# Altium schematic sheet 50Hz_GEN_LPF.SchDoc: 50 Hz Sine Gen LPF
size A4; Organization: Altium Limited; Address1: L3, 12a Rodborough Rd; Address2: Frenchs Forest; Address3: NSW; Address4: Australia 2086
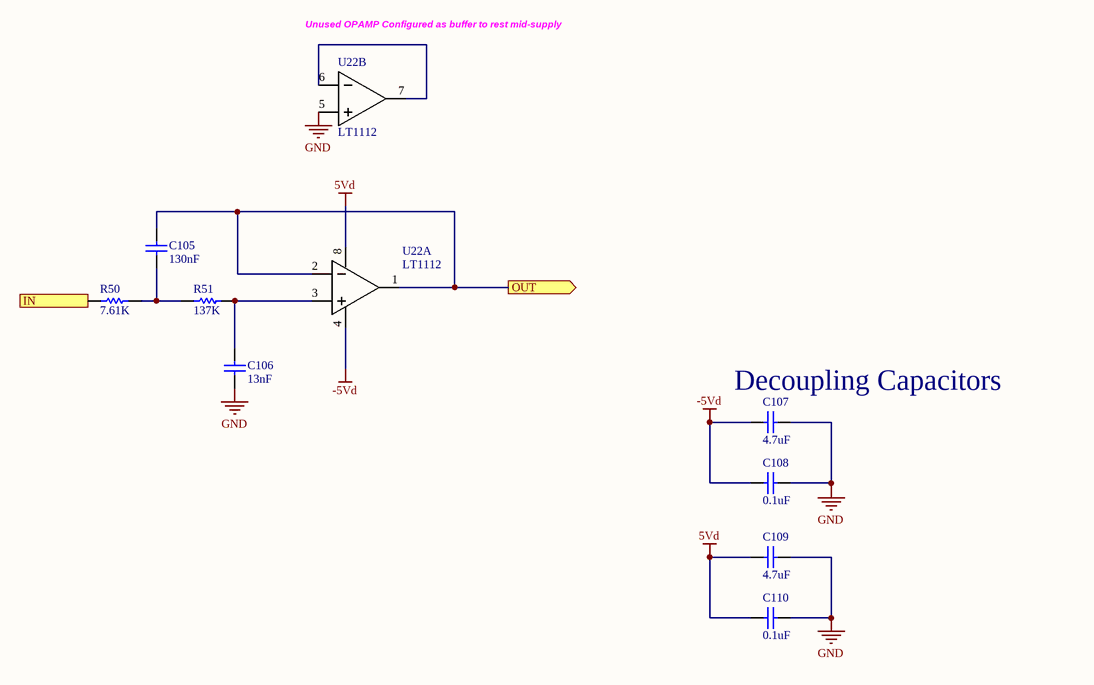
[diagram p0: 50Hz_GEN_LPF.SchDoc]

## Parts
C105  130nF  [0402_Cap]
C106  13nF  [0402_Cap]
C107  4.7uF  [0402_Cap]
C108  0.1uF  [0402_Cap]
C109  4.7uF  [0402_Cap]
C110  0.1uF  [0402_Cap]
R50  7.61K  [0402_Res]
R51  137K  [0402_Res]
U22  LT1112  [SOIC_8]  (parts A,B of 2)

## Ports
IN (in), OUT (out)

## Nets
5Vd: C109.1 C110.1 U22.8
-5Vd: C107.1 C108.1 U22.4
GND: C106.1 C107.2 C108.2 C109.2 C110.2 U22.5
IN: R50.1 ; port IN
OUT: C105.2 U22.1 U22.2 ; port OUT
NetC105_1: C105.1 R50.2 R51.1
NetC106_2: C106.2 R51.2 U22.3
NetU22_6: U22.6 U22.7

## Notes on the sheet
- Unused OPAMP Configured as buffer to rest mid-supply
- (near C107) Decoupling Capacitors
- Title
- Date:
- RE:
- Arturo di Girolamo
- Size:
- A3
- A

## Library data of the parts
C105 = 08051C163JAT2A: Capacitor, 16nF, 0805, 25V; ASYPN: GRM155R61A124KE19D; Value: 16nF; MFGPN: 08051C163JAT2A
C106 = GRM2165C2A162JA01D: Capacitor, 1.6nF, 0805, 25V; ASYPN: C0402C123K8PACTU; Value: 1.6nF; MFGPN: GRM2165C2A162JA01D
C107 C109 = CL21A475KAQNNNE: Capacitor, 4.7uF, 0805; Value: .01uf; ASYPN: GRM155R61A475MEAAD; MFGPN: CL21A475KAQNNNE
C108 C110 = CL21B104KACNNNC: Capacitor, 0.1uF, 0805; Value: .01uf; ASYPN: 0402YC104KAT2A; MFGPN: CL21B104KACNNNC
R50 = RC0805FR-071K65L: 1.65k; ASYPN: MCS0402MD7501BE100; Value: 1.65k; MFGPN: RC0805FR-071K65L
R51 = RC0805FR-075K9L: 5.9k; ASYPN: RMCF0402FT137K; Value: 5.9k; MFGPN: RC0805FR-075K9L
U22 = LT1112: ASYPN: LT1112IS8#PBF